# Altium schematic sheet 12 Proc Pwr2.SchDoc
size 420 x 297 mm
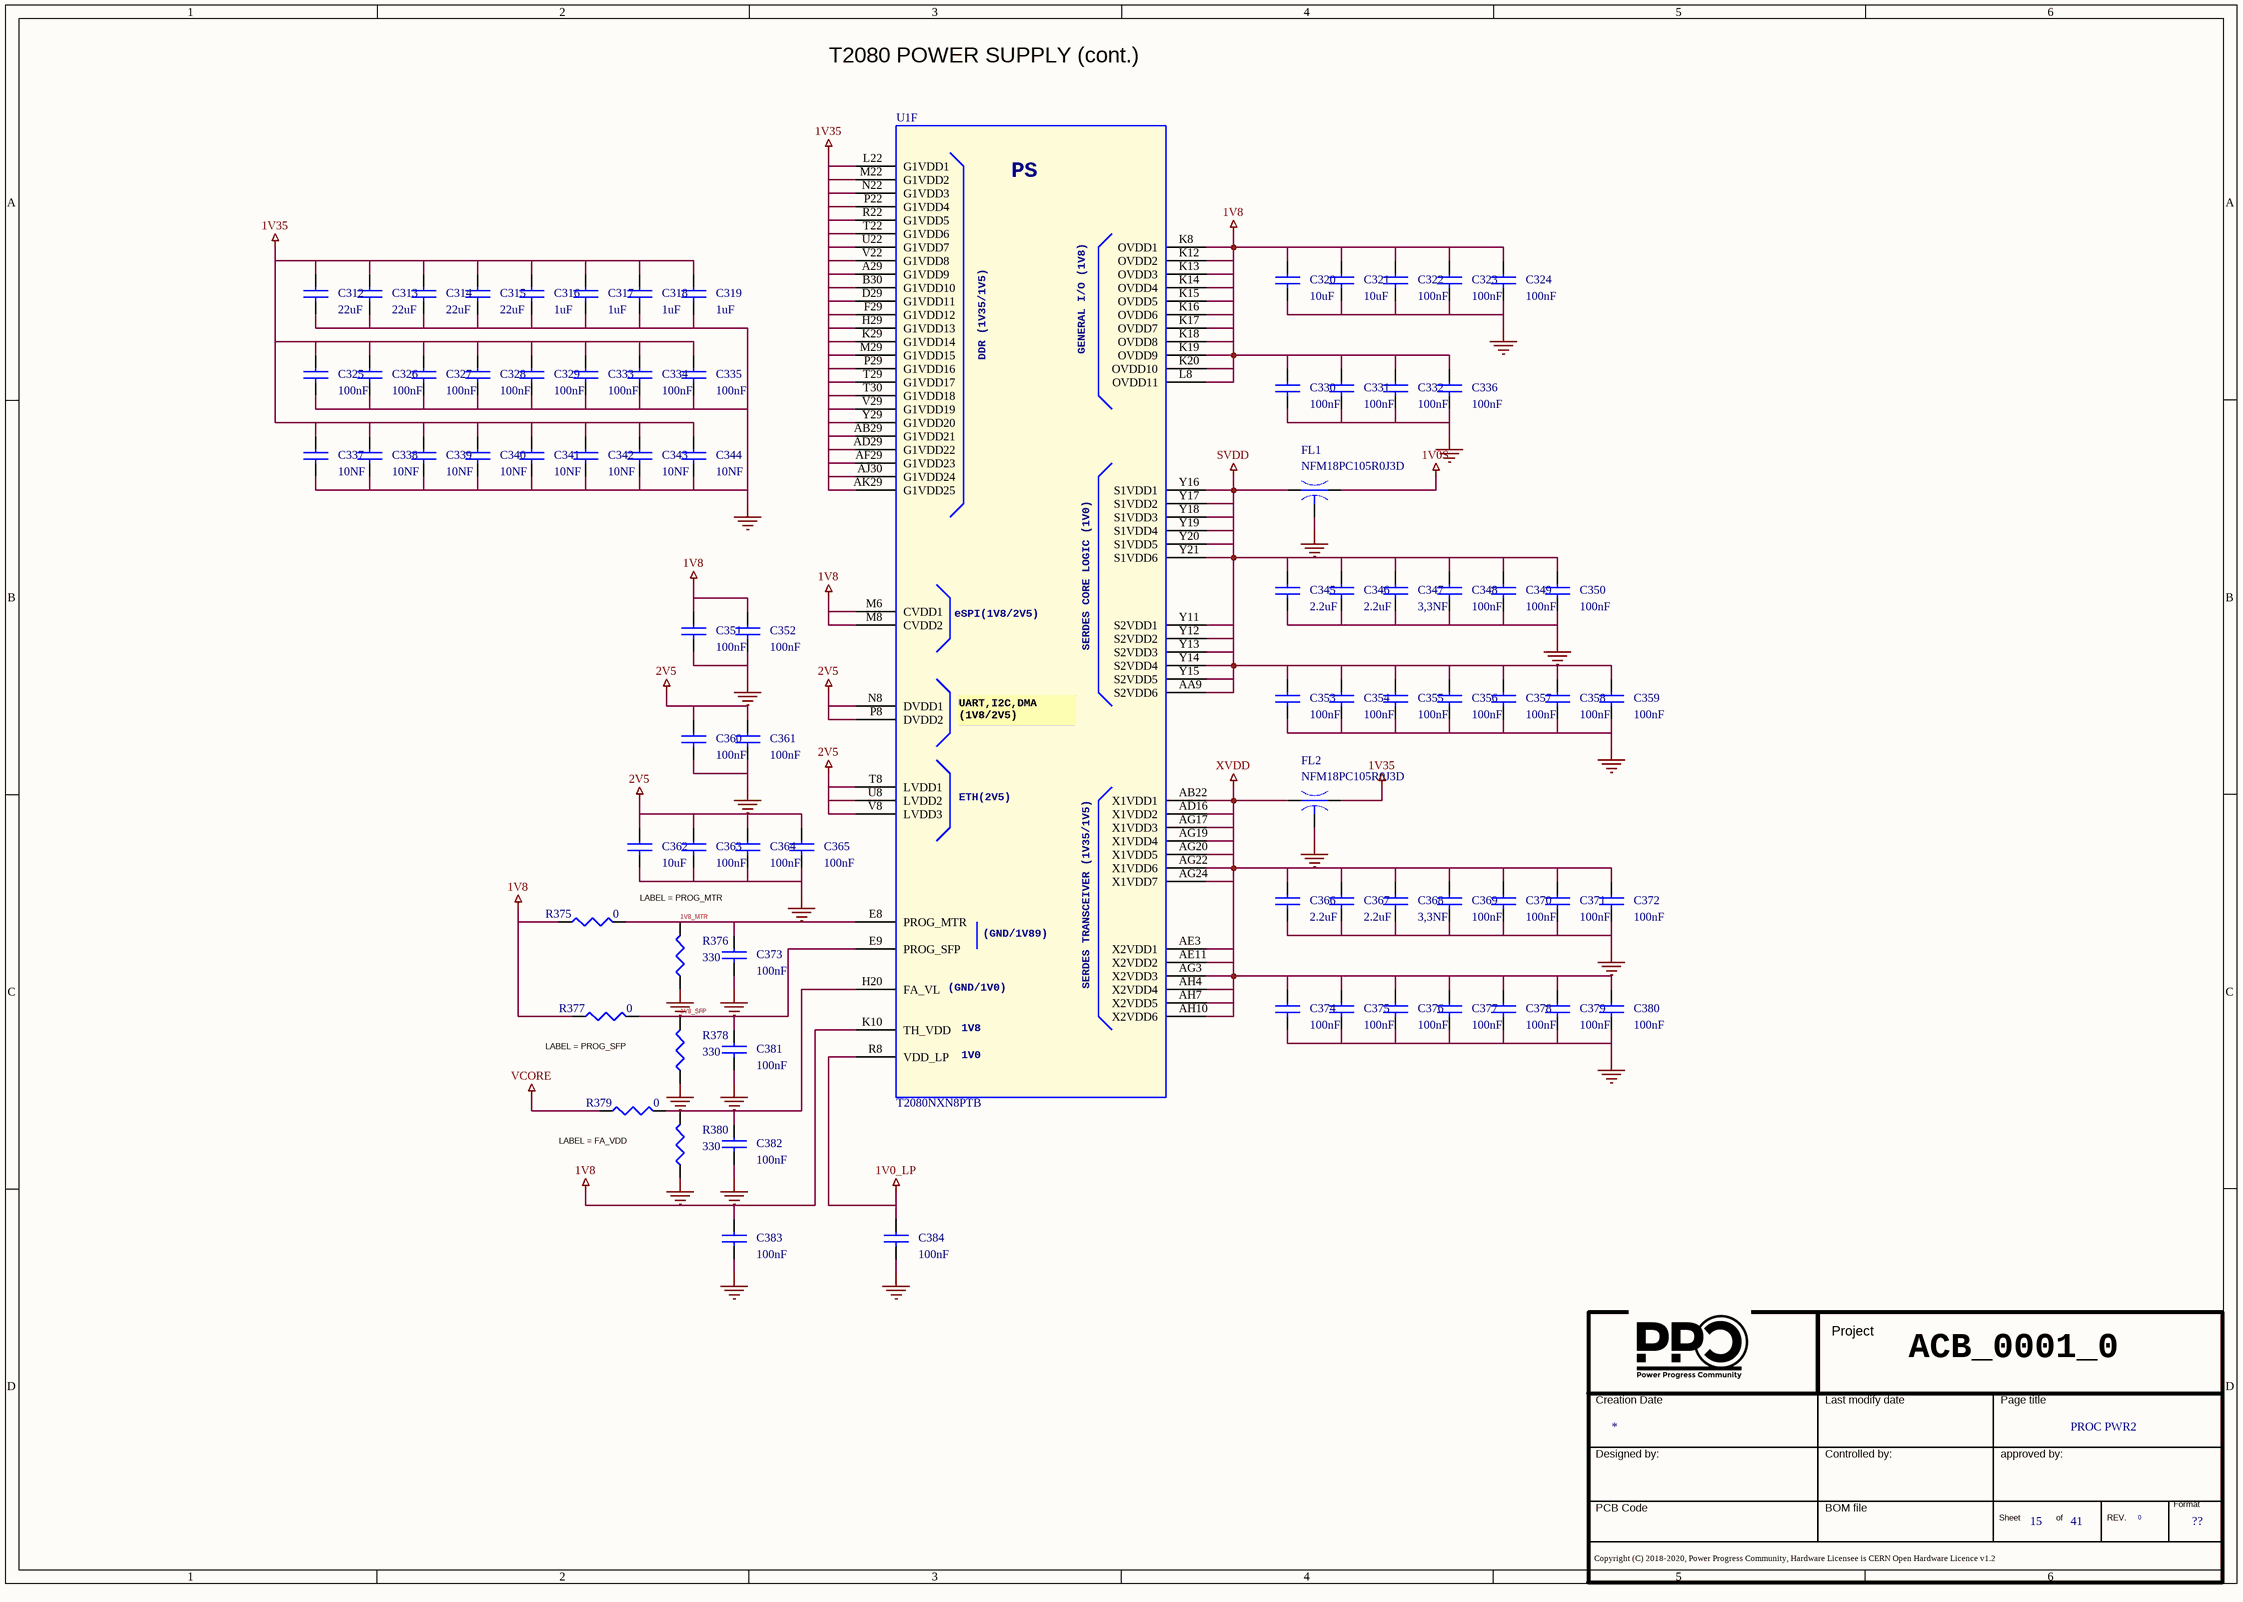
[diagram p0: 12 Proc Pwr2.SchDoc]

## Parts
*  Doc: PROC PWR2  Page Count: 41  Page Number: 15  Page Size: ??  RevCode: 0  (hidden comment: Title_block_PPC)  (graphical)
C312  22uF  [SMD_0805]
C313  22uF  [SMD_0805]
C314  22uF  [SMD_0805]
C315  22uF  [SMD_0805]
C316  1uF  [SMD_0402]
C317  1uF  [SMD_0402]
C318  1uF  [SMD_0402]
C319  1uF  [SMD_0402]
C320  10uF  [SMD_0603]
C321  10uF  [SMD_0603]
C322  100nF  [SMD_0201]
C323  100nF  [SMD_0201]
C324  100nF  [SMD_0201]
C325  100nF  [SMD_0201]
C326  100nF  [SMD_0201]
C327  100nF  [SMD_0201]
C328  100nF  [SMD_0201]
C329  100nF  [SMD_0201]
C330  100nF  [SMD_0201]
C331  100nF  [SMD_0201]
C332  100nF  [SMD_0201]
C333  100nF  [SMD_0201]
C334  100nF  [SMD_0201]
C335  100nF  [SMD_0201]
C336  100nF  [SMD_0201]
C337  10NF  [SMD_0402]
C338  10NF  [SMD_0402]
C339  10NF  [SMD_0402]
C340  10NF  [SMD_0402]
C341  10NF  [SMD_0402]
C342  10NF  [SMD_0402]
C343  10NF  [SMD_0402]
C344  10NF  [SMD_0402]
C345  2.2uF  [SMD_0402]
C346  2.2uF  [SMD_0402]
C347  3,3NF  [SMD_0402]
C348  100nF  [SMD_0201]
C349  100nF  [SMD_0201]
C350  100nF  [SMD_0201]
C351  100nF  [SMD_0201]
C352  100nF  [SMD_0201]
C353  100nF  [SMD_0201]
C354  100nF  [SMD_0201]
C355  100nF  [SMD_0201]
C356  100nF  [SMD_0201]
C357  100nF  [SMD_0201]
C358  100nF  [SMD_0201]
C359  100nF  [SMD_0201]
C360  100nF  [SMD_0201]
C361  100nF  [SMD_0201]
C362  10uF  [SMD_0603]
C363  100nF  [SMD_0201]
C364  100nF  [SMD_0201]
C365  100nF  [SMD_0402]
C366  2.2uF  [SMD_0402]
C367  2.2uF  [SMD_0402]
C368  3,3NF  [SMD_0402]
C369  100nF  [SMD_0201]
C370  100nF  [SMD_0201]
C371  100nF  [SMD_0201]
C372  100nF  [SMD_0201]
C373  100nF  [SMD_0201]
C374  100nF  [SMD_0201]
C375  100nF  [SMD_0201]
C376  100nF  [SMD_0201]
C377  100nF  [SMD_0201]
C378  100nF  [SMD_0201]
C379  100nF  [SMD_0201]
C380  100nF  [SMD_0201]
C381  100nF  [SMD_0201]
C382  100nF  [SMD_0402]
C383  100nF  [SMD_0201]
C384  100nF  [SMD_0201]
FL1  NFM18PC105R0J3D  [SMD_0603]
FL2  NFM18PC105R0J3D  [SMD_0603]
R375  0  [SMD_1206]
R376  330  [SMD_0402]
R377  0  [SMD_1206]
R378  330  [SMD_0402]
R379  0  [SMD_1206]
R380  330  [SMD_0402]
U1  T2080NXN8PTB  [bga]  (part F of 14)

## Nets
1V0_LP: C384.1 U1.R8(VDD_LP)
1V0S: FL1.1(IN)
1V8: C320.1 C321.1 C322.1 C323.1 C324.1 C330.1 C331.1 C332.1 C336.1 C351.1 C352.1 C383.1 R375.1 R377.1 U1.K8(OVDD1) U1.K10(TH_VDD) U1.K12(OVDD2) U1.K13(OVDD3) U1.K14(OVDD4) U1.K15(OVDD5) U1.K16(OVDD6) U1.K17(OVDD7) U1.K18(OVDD8) U1.K19(OVDD9) U1.K20(OVDD10) U1.L8(OVDD11) U1.M6(CVDD1) U1.M8(CVDD2)
1V35: C312.1 C313.1 C314.1 C315.1 C316.1 C317.1 C318.1 C319.1 C325.1 C326.1 C327.1 C328.1 C329.1 C333.1 C334.1 C335.1 C337.1 C338.1 C339.1 C340.1 C341.1 C342.1 C343.1 C344.1 FL2.1(IN) U1.A29(G1VDD9) U1.AB29(G1VDD21) U1.AD29(G1VDD22) U1.AF29(G1VDD23) U1.AJ30(G1VDD24) U1.AK29(G1VDD25) U1.B30(G1VDD10) U1.D29(G1VDD11) U1.F29(G1VDD12) U1.H29(G1VDD13) U1.K29(G1VDD14) U1.L22(G1VDD1) U1.M22(G1VDD2) U1.M29(G1VDD15) U1.N22(G1VDD3) U1.P22(G1VDD4) U1.P29(G1VDD16) U1.R22(G1VDD5) U1.T22(G1VDD6) U1.T29(G1VDD17) U1.T30(G1VDD18) U1.U22(G1VDD7) U1.V22(G1VDD8) U1.V29(G1VDD19) U1.Y29(G1VDD20)
2V5: C360.1 C361.1 C362.1 C363.1 C364.1 C365.1 U1.N8(DVDD1) U1.P8(DVDD2) U1.T8(LVDD1) U1.U8(LVDD2) U1.V8(LVDD3)
GND: C312.2 C313.2 C314.2 C315.2 C316.2 C317.2 C318.2 C319.2 C320.2 C321.2 C322.2 C323.2 C324.2 C325.2 C326.2 C327.2 C328.2 C329.2 C330.2 C331.2 C332.2 C333.2 C334.2 C335.2 C336.2 C337.2 C338.2 C339.2 C340.2 C341.2 C342.2 C343.2 C344.2 C345.2 C346.2 C347.2 C348.2 C349.2 C350.2 C351.2 C352.2 C353.2 C354.2 C355.2 C356.2 C357.2 C358.2 C359.2 C360.2 C361.2 C362.2 C363.2 C364.2 C365.2 C366.2 C367.2 C368.2 C369.2 C370.2 C371.2 C372.2 C373.2 C374.2 C375.2 C376.2 C377.2 C378.2 C379.2 C380.2 C381.2 C382.2 C383.2 C384.2 FL1.2(GND) FL2.2(GND) R376.1 R378.1 R380.1
SVDD: C345.1 C346.1 C347.1 C348.1 C349.1 C350.1 C353.1 C354.1 C355.1 C356.1 C357.1 C358.1 C359.1 FL1.3(OUT) U1.AA9(S2VDD6) U1.Y11(S2VDD1) U1.Y12(S2VDD2) U1.Y13(S2VDD3) U1.Y14(S2VDD4) U1.Y15(S2VDD5) U1.Y16(S1VDD1) U1.Y17(S1VDD2) U1.Y18(S1VDD3) U1.Y19(S1VDD4) U1.Y20(S1VDD5) U1.Y21(S1VDD6)
VCORE: R379.1
XVDD: C366.1 C367.1 C368.1 C369.1 C370.1 C371.1 C372.1 C374.1 C375.1 C376.1 C377.1 C378.1 C379.1 C380.1 FL2.3(OUT) U1.AB22(X1VDD1) U1.AD16(X1VDD2) U1.AE3(X2VDD1) U1.AE11(X2VDD2) U1.AG3(X2VDD3) U1.AG17(X1VDD3) U1.AG19(X1VDD4) U1.AG20(X1VDD5) U1.AG22(X1VDD6) U1.AG24(X1VDD7) U1.AH4(X2VDD4) U1.AH7(X2VDD5) U1.AH10(X2VDD6)
1V8_MTR: C373.1 R375.2 R376.2 U1.E8(PROG_MTR)
1V8_SFP: C381.1 R377.2 R378.2 U1.E9(PROG_SFP)
NetC382_1: C382.1 R379.2 R380.2 U1.H20(FA_VL)

## Notes on the sheet
- T2080 POWER SUPPLY (cont.)
- LABEL = PROG_MTR
- (near R377) LABEL = PROG_SFP
- (near R379) LABEL = FA_VDD
- ACB_0001_0
- (in symbol T2080, part F) PS; GENERAL I/O (1V8); DDR (1V35/1V5); eSPI(1V8/2V5); SERDES CORE LOGIC (1V0); UART,I2C,DMA / (1V8/2V5); ETH(2V5); (GND/1V89); SERDES TRANSCEIVER (1V35/1V5); (GND/1V0); 1V8; 1V0
- (in symbol Title_block_PPC) Project; Creation Date; Last modify date; Page title; Designed by:; Controlled by:; approved by:; Format; PCB Code; BOM file; Sheet; of; REV.; Copyright (C) 2018-2020, Power Progress Community, Hardware Licensee is CERN Open Hardware Licence v1.2

## Library data of the parts
* = Title_block_PPC: Title: T2080PCIe; Schematic Page Count: 45; Schematic Page Number: 17; Author: MICETEK; Page Create Date: March  8, 1995; Page Title: ?; Page Modify Date: *
C312-C315 = CAP NP_Dup2: 22UF 35V 20% 0805; Manufacturer Part Number 1: C2012X5R1V226M125AC; Manufacturer 1: TDK; Part Number: PASSIVE_224; RSM: RC0805; PCB Footprint: SMD_0805; Part Type: Capacitors\Ceramic\SMD\0805
C316-C319 = CAP NP_Dup2: CAP CER 1UF 25V X6S 0402; Manufacturer Part Number 1: GRM155C81E105KE11D; Manufacturer 1: Murata; Part Number: PASSIVE_1446; RSM: RC0402; PCB Footprint: SMD_0402; Part Type: Capacitors\Ceramic\SMD\0402
C320 C321 C362 = CAP NP_Dup2: COND.CER.10uF 0603 25V SMD; Manufacturer Part Number 1: CL10A106MA8NRNC; Manufacturer 1: SAMSUNG; Part Number: PASSIVE_124; RSM: RC0603; PCB Footprint: SMD_0603; Part Type: Capacitors\Ceramic\SMD\0603
C322-C336 C348-C361 C363 C364 C369-C381 C383 C384 = CAP NP_Dup2: CAP CER 0.1UF 6.3V 20% X5R 0201; Manufacturer Part Number 1: C0603X5R0J104M030BC; Manufacturer 1: TDK; Part Number: PASSIVE_3; RSM: RC0201; PCB Footprint: SMD_0201; Part Type: Capacitors\Ceramic\SMD\0201
C337-C344 = CAP NP_Dup2: COND.CER. 10NF 16V 0402 X7R SMD; Manufacturer Part Number 1: 0402YC103KAT2A; Manufacturer 1: AVX; Part Number: PASSIVE_28; RSM: RC0402; PCB Footprint: SMD_0402; Part Type: Capacitors\Ceramic\SMD\0402
C345 C346 C366 C367 = CAP NP_Dup2: CAP CER 2.2UF 25V X5R 0402; Manufacturer Part Number 1: GRM155R61E225ME15D; Manufacturer 1: Murata; Part Number: PASSIVE_1448; RSM: RC0402; PCB Footprint: SMD_0402; Part Type: Capacitors\Ceramic\SMD\0402
C347 C368 = CAP NP_Dup2: COND.CER. 3,3NF 50V 0402 X7R SMD; Part Number: PASSIVE_69; RSM: RC0402; PCB Footprint: SMD_0402; Part Type: Capacitors\Ceramic\SMD\0402
C365 C382 = CAP NP_Dup2: COND.CER. 100NF 50V 0402 X7R SMD; Manufacturer Part Number 1: CGA2B3X7R1H104M050BD; Manufacturer 1: TDK; Part Number: PASSIVE_24; RSM: RC0402; PCB Footprint: SMD_0402; Part Type: Capacitors\Ceramic\SMD\0402
FL1 = CAP_EMI_FIL: FILTER LC HIGH FREQ 1UF 0603; Manufacturer 1: Murata; Part Number: PASSIVE_348; RSM: EMI-NFM18-0603; Manufacturer Part Number 1: NFM18PC105R0J3D; Part Type: FILTER\CAP_FIL; PCB Footprint: SMD_0603
FL2 = CAP_EMI_FIL: FILTER LC HIGH FREQ 1UF 0603; Part Number: PASSIVE_348; Manufacturer 1: Murata; RSM: EMI-NFM18-0603; Part Type: FILTER\CAP_FIL; Manufacturer Part Number 1: NFM18PC105R0J3D; PCB Footprint: SMD_0603
R375 R377 R379 = R_Dup5: RESIS. 0R 1/4W 1206 SMD E96; Manufacturer Part Number 1: CR32000ZL; Manufacturer 1: ASJ; Part Number: PASSIVE_1266; RSM: RC1206; Part Type: Resistors\Fixed\SMD\1206\5%; PCB Footprint: SMD_1206
R376 R378 R380 = R_Dup5: RESIS.CHIP 330R 5% 0402 SMD; Part Number: PASSIVE_854; Manufacturer 1: ROYAL OHM; RSM: RC0402; Part Type: Resistors\Fixed\SMD\0402\5%; Manufacturer Part Number 1: RESIS.CHIP 330R 5% 0402 SMD; PCB Footprint: SMD_0402
U1 = T2080: QRIQ MPU 1.87GT/s DDR3/3L 4x10GE; Part Number: MICROPROCESSOR_65; Manufacturer 1: NXP; Vendor: Freescale; PCB Footprint: BGA896; RSM: PBGA896-0_8MM-25X25; MPN: T2080; TYPE: IC; Part Type: 32 BIT; Manufacturer Part Number 1: T2080NXN8PTB; Distributor 1: MOUSER(841-T2080NXN8PTB)